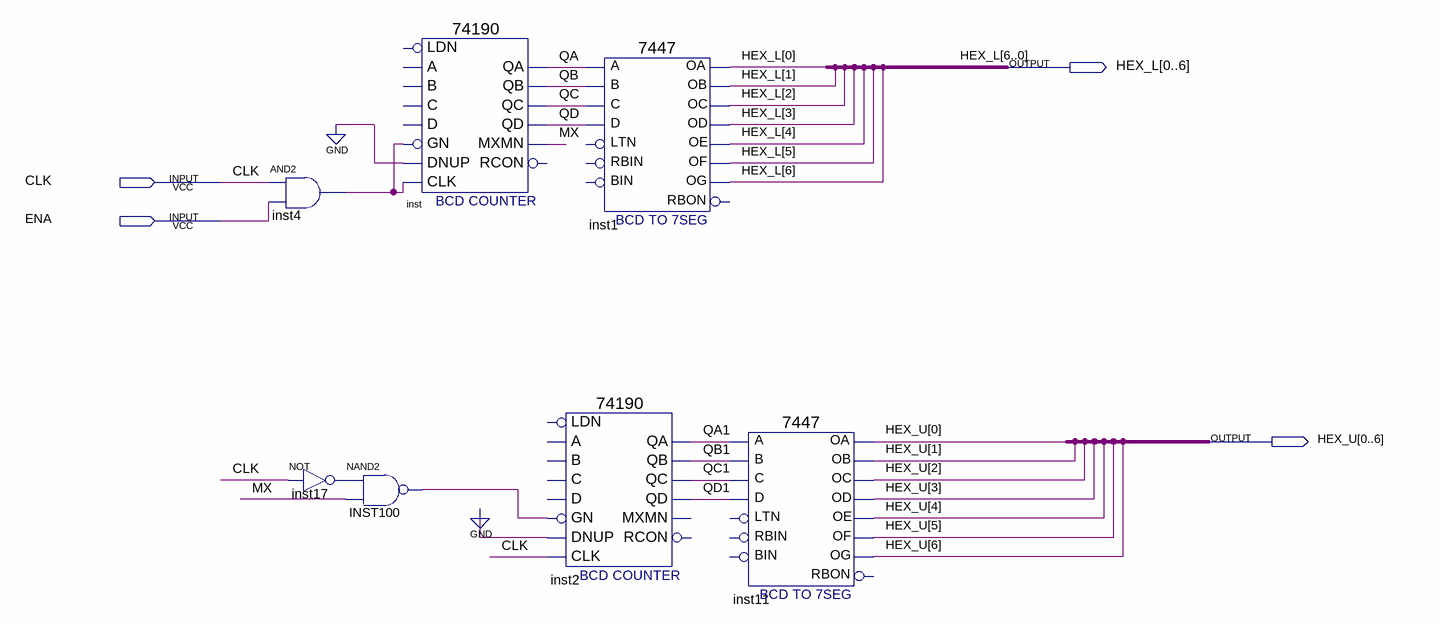
[diagram p0: schematic sheet]
// Quartus schematic turnCounter.bdf as structural Verilog: 7 symbols, 4 pins
module turnCounter (
  input  CLK,
  input  ENA,
  output [0:6] HEX_L,
  output [0:6] HEX_U
);

  wire inst4_out, inst17_out, INST100_out, MX, QA, QA1, QB, QB1, QC, QC1, QD, QD1;

  and inst4 (inst4_out, CLK, ENA);
  not inst17 (inst17_out, CLK);
  nand INST100 (INST100_out, inst17_out, MX);
  \74190  inst (
    .GN(inst4_out), .CLK(inst4_out), .DNUP(1'b0), .QA(QA), .QB(QB), .QD(QD), .QC(QC), .MXMN(MX));  // open: LDN, A, C, B, D, RCON
  \74190  inst2 (
    .GN(INST100_out), .CLK(CLK), .DNUP(1'b0), .QA(QA1), .QB(QB1), .QD(QD1), .QC(QC1));  // open: LDN, A, C, B, D, MXMN, RCON
  \7447  inst1 (
    .B(QB), .C(QC), .D(QD), .A(QA), .OB(HEX_L[1]), .OC(HEX_L[2]), .OE(HEX_L[4]), .OD(HEX_L[3]),
    .OF(HEX_L[5]), .OG(HEX_L[6]), .OA(HEX_L[0]));  // open: LTN, RBIN, BIN, RBON
  \7447  inst11 (
    .B(QB1), .C(QC1), .D(QD1), .A(QA1), .OB(HEX_U[1]), .OC(HEX_U[2]), .OE(HEX_U[4]), .OD(HEX_U[3]),
    .OF(HEX_U[5]), .OG(HEX_U[6]), .OA(HEX_U[0]));  // open: LTN, RBIN, BIN, RBON
endmodule
